# Altium schematic sheet DDR4_SODIMM1_Arria10.SchDoc: DDR4 SODIMM Arria10
size B; DocumentNumber: 21; SheetNumber: 21; SheetTotal: 46
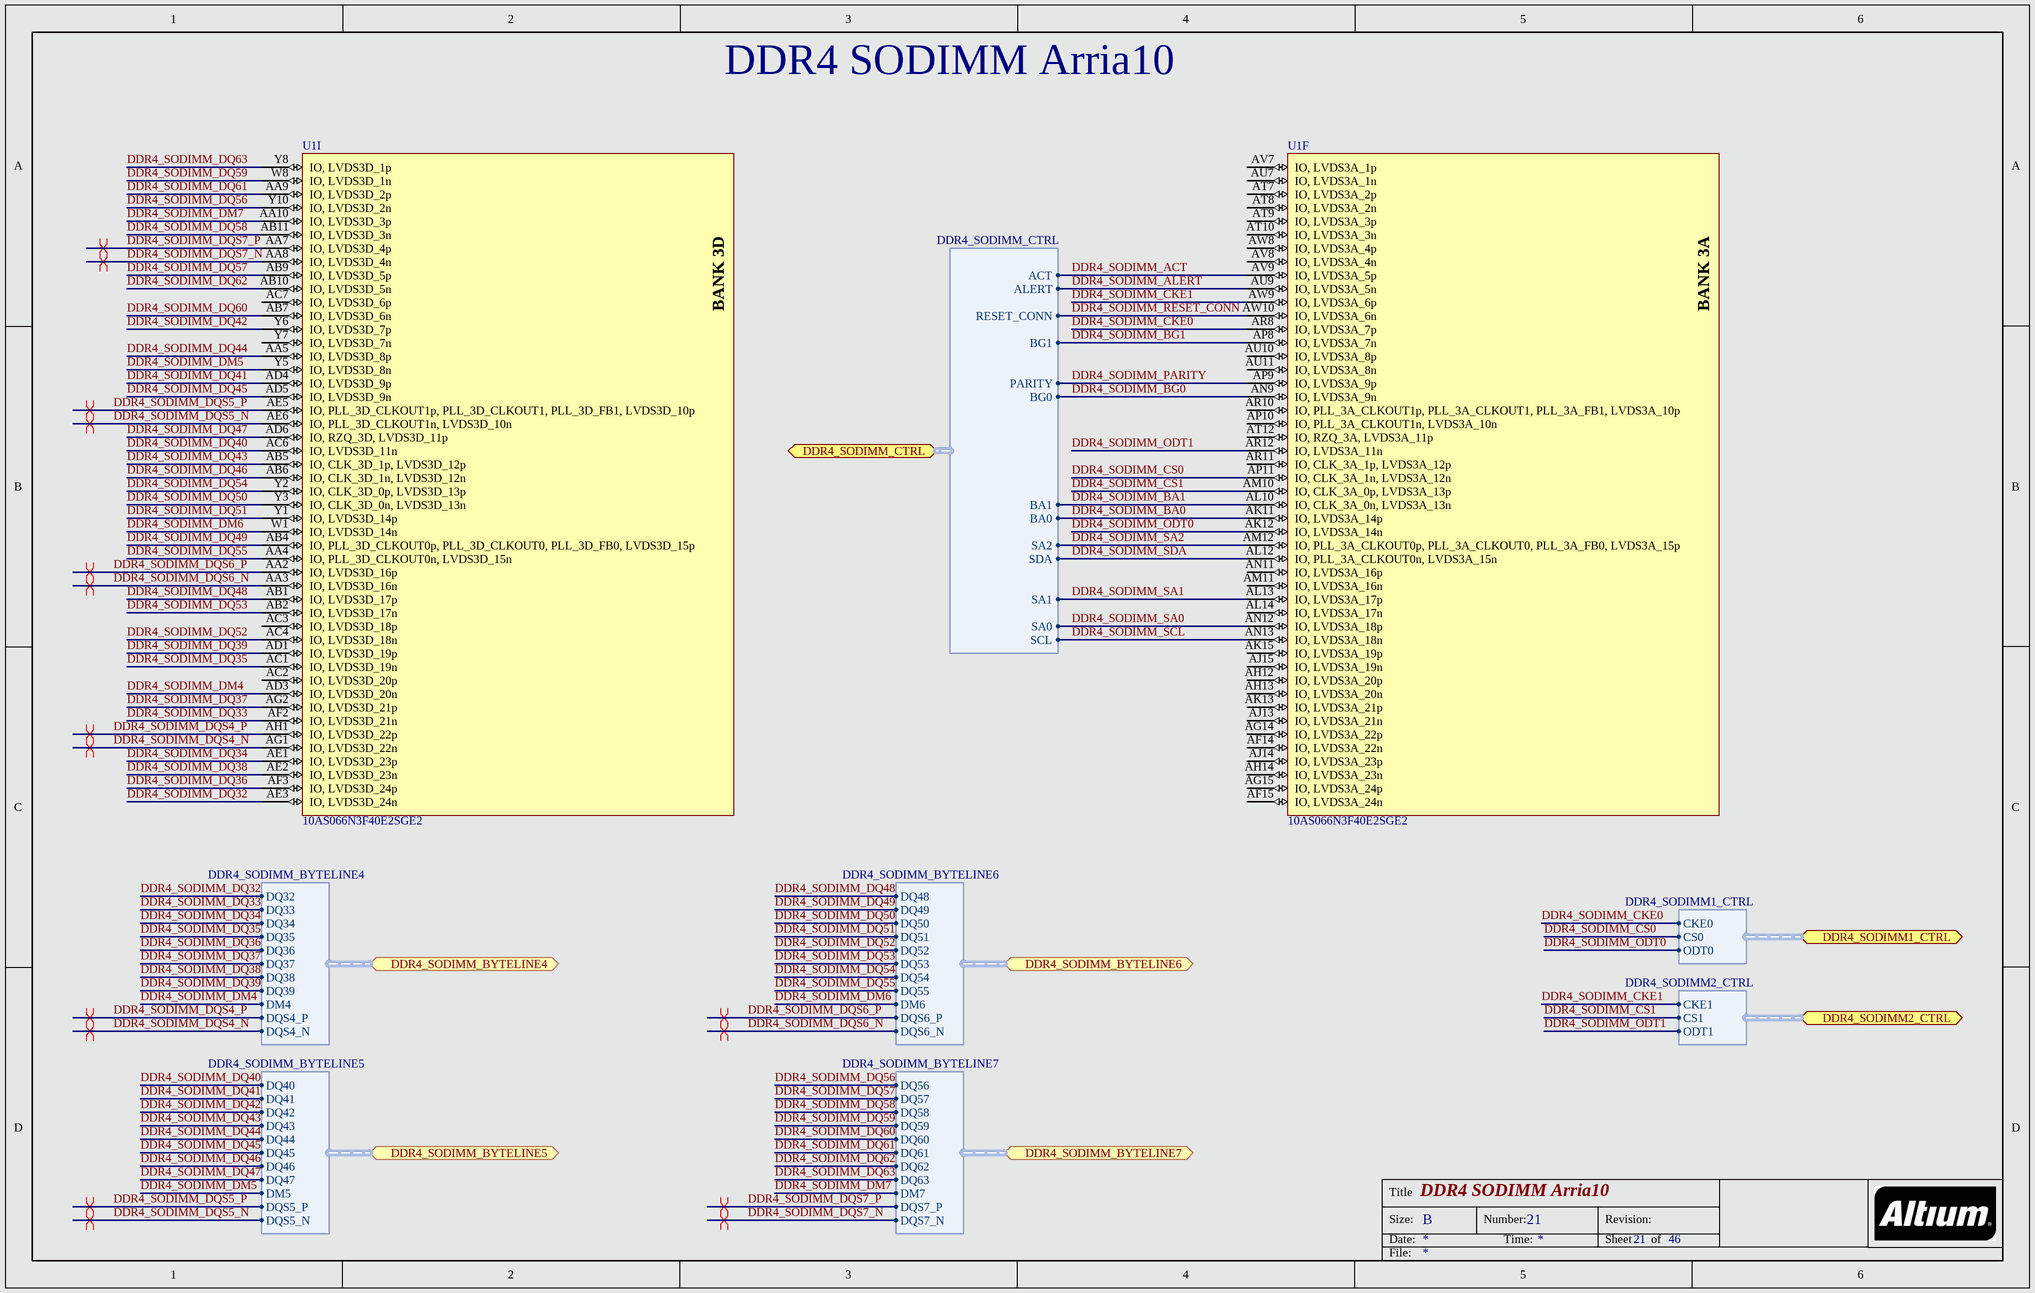
[diagram p0: DDR4_SODIMM1_Arria10.SchDoc]

## Parts
U1  10AS066N3F40E2SGE2  [ALTR-FBGA1517_A-350]  (parts F,I of 31)

## Ports
DDR4_SODIMM1_CTRL (harness DDR4_SODIMM1_CTRL), DDR4_SODIMM2_CTRL (harness DDR4_SODIMM2_CTRL), DDR4_SODIMM_BYTELINE4 (harness DDR4_SODIMM_BYTELINE4), DDR4_SODIMM_BYTELINE5 (harness DDR4_SODIMM_BYTELINE5), DDR4_SODIMM_BYTELINE6 (harness DDR4_SODIMM_BYTELINE6), DDR4_SODIMM_BYTELINE7 (harness DDR4_SODIMM_BYTELINE7), DDR4_SODIMM_CTRL (harness DDR4_SODIMM_CTRL)

## Harnesses
DDR4_SODIMM_BYTELINE4: DQ32, DQ33, DQ34, DQ35, DQ36, DQ37, DQ38, DQ39, DM4, DQS4_P, DQS4_N
DDR4_SODIMM_BYTELINE5: DQ40, DQ41, DQ42, DQ43, DQ44, DQ45, DQ46, DQ47, DM5, DQS5_P, DQS5_N
DDR4_SODIMM_BYTELINE6: DQ48, DQ49, DQ50, DQ51, DQ52, DQ53, DQ54, DQ55, DM6, DQS6_P, DQS6_N
DDR4_SODIMM_BYTELINE7: DQ56, DQ57, DQ58, DQ59, DQ60, DQ61, DQ62, DQ63, DM7, DQS7_P, DQS7_N
DDR4_SODIMM1_CTRL: CKE0, CS0, ODT0
DDR4_SODIMM2_CTRL: CKE1, CS1, ODT1
DDR4_SODIMM_CTRL: SA0, SA1, SA2, BA0, BA1, BG0, BG1, SCL, SDA, RESET_CONN, ACT, ALERT, PARITY

## Nets
DDR4_SODIMM_ACT: U1.AV9(IO,_LVDS3A_5p) ; port DDR4_SODIMM_CTRL.ACT
DDR4_SODIMM_ALERT: U1.AU9(IO,_LVDS3A_5n) ; port DDR4_SODIMM_CTRL.ALERT
DDR4_SODIMM_BA0: U1.AK11(IO,_LVDS3A_14p) ; port DDR4_SODIMM_CTRL.BA0
DDR4_SODIMM_BA1: U1.AL10(IO,_CLK_3A_0n,_LVDS3A_13n) ; port DDR4_SODIMM_CTRL.BA1
DDR4_SODIMM_BG0: U1.AN9(IO,_LVDS3A_9n) ; port DDR4_SODIMM_CTRL.BG0
DDR4_SODIMM_BG1: U1.AP8(IO,_LVDS3A_7n) ; port DDR4_SODIMM_CTRL.BG1
DDR4_SODIMM_CKE0: U1.AR8(IO,_LVDS3A_7p) ; port DDR4_SODIMM1_CTRL.CKE0
DDR4_SODIMM_CKE1: U1.AW9(IO,_LVDS3A_6p) ; port DDR4_SODIMM2_CTRL.CKE1
DDR4_SODIMM_CS0: U1.AP11(IO,_CLK_3A_1n,_LVDS3A_12n) ; port DDR4_SODIMM1_CTRL.CS0
DDR4_SODIMM_CS1: U1.AM10(IO,_CLK_3A_0p,_LVDS3A_13p) ; port DDR4_SODIMM2_CTRL.CS1
DDR4_SODIMM_DM4: U1.AD3(IO,_LVDS3D_20n) ; port DDR4_SODIMM_BYTELINE4.DM4
DDR4_SODIMM_DM5: U1.Y5(IO,_LVDS3D_8n) ; port DDR4_SODIMM_BYTELINE5.DM5
DDR4_SODIMM_DM6: U1.W1(IO,_LVDS3D_14n) ; port DDR4_SODIMM_BYTELINE6.DM6
DDR4_SODIMM_DM7: U1.AA10(IO,_LVDS3D_3p) ; port DDR4_SODIMM_BYTELINE7.DM7
DDR4_SODIMM_DQ32: U1.AE3(IO,_LVDS3D_24n) ; port DDR4_SODIMM_BYTELINE4.DQ32
DDR4_SODIMM_DQ33: U1.AF2(IO,_LVDS3D_21n) ; port DDR4_SODIMM_BYTELINE4.DQ33
DDR4_SODIMM_DQ34: U1.AE1(IO,_LVDS3D_23p) ; port DDR4_SODIMM_BYTELINE4.DQ34
DDR4_SODIMM_DQ35: U1.AC1(IO,_LVDS3D_19n) ; port DDR4_SODIMM_BYTELINE4.DQ35
DDR4_SODIMM_DQ36: U1.AF3(IO,_LVDS3D_24p) ; port DDR4_SODIMM_BYTELINE4.DQ36
DDR4_SODIMM_DQ37: U1.AG2(IO,_LVDS3D_21p) ; port DDR4_SODIMM_BYTELINE4.DQ37
DDR4_SODIMM_DQ38: U1.AE2(IO,_LVDS3D_23n) ; port DDR4_SODIMM_BYTELINE4.DQ38
DDR4_SODIMM_DQ39: U1.AD1(IO,_LVDS3D_19p) ; port DDR4_SODIMM_BYTELINE4.DQ39
DDR4_SODIMM_DQ40: U1.AC6(IO,_LVDS3D_11n) ; port DDR4_SODIMM_BYTELINE5.DQ40
DDR4_SODIMM_DQ41: U1.AD4(IO,_LVDS3D_9p) ; port DDR4_SODIMM_BYTELINE5.DQ41
DDR4_SODIMM_DQ42: U1.Y6(IO,_LVDS3D_7p) ; port DDR4_SODIMM_BYTELINE5.DQ42
DDR4_SODIMM_DQ43: U1.AB5(IO,_CLK_3D_1p,_LVDS3D_12p) ; port DDR4_SODIMM_BYTELINE5.DQ43
DDR4_SODIMM_DQ44: U1.AA5(IO,_LVDS3D_8p) ; port DDR4_SODIMM_BYTELINE5.DQ44
DDR4_SODIMM_DQ45: U1.AD5(IO,_LVDS3D_9n) ; port DDR4_SODIMM_BYTELINE5.DQ45
DDR4_SODIMM_DQ46: U1.AB6(IO,_CLK_3D_1n,_LVDS3D_12n) ; port DDR4_SODIMM_BYTELINE5.DQ46
DDR4_SODIMM_DQ47: U1.AD6(IO,_RZQ_3D,_LVDS3D_11p) ; port DDR4_SODIMM_BYTELINE5.DQ47
DDR4_SODIMM_DQ48: U1.AB1(IO,_LVDS3D_17p) ; port DDR4_SODIMM_BYTELINE6.DQ48
DDR4_SODIMM_DQ49: U1.AB4(IO,_PLL_3D_CLKOUT0p,_PLL_3D_CLKOUT0,_PLL_3D_FB0,_LVDS3D_15p) ; port DDR4_SODIMM_BYTELINE6.DQ49
DDR4_SODIMM_DQ50: U1.Y3(IO,_CLK_3D_0n,_LVDS3D_13n) ; port DDR4_SODIMM_BYTELINE6.DQ50
DDR4_SODIMM_DQ51: U1.Y1(IO,_LVDS3D_14p) ; port DDR4_SODIMM_BYTELINE6.DQ51
DDR4_SODIMM_DQ52: U1.AC4(IO,_LVDS3D_18n) ; port DDR4_SODIMM_BYTELINE6.DQ52
DDR4_SODIMM_DQ53: U1.AB2(IO,_LVDS3D_17n) ; port DDR4_SODIMM_BYTELINE6.DQ53
DDR4_SODIMM_DQ54: U1.Y2(IO,_CLK_3D_0p,_LVDS3D_13p) ; port DDR4_SODIMM_BYTELINE6.DQ54
DDR4_SODIMM_DQ55: U1.AA4(IO,_PLL_3D_CLKOUT0n,_LVDS3D_15n) ; port DDR4_SODIMM_BYTELINE6.DQ55
DDR4_SODIMM_DQ56: U1.Y10(IO,_LVDS3D_2n) ; port DDR4_SODIMM_BYTELINE7.DQ56
DDR4_SODIMM_DQ57: U1.AB9(IO,_LVDS3D_5p) ; port DDR4_SODIMM_BYTELINE7.DQ57
DDR4_SODIMM_DQ58: U1.AB11(IO,_LVDS3D_3n) ; port DDR4_SODIMM_BYTELINE7.DQ58
DDR4_SODIMM_DQ59: U1.W8(IO,_LVDS3D_1n) ; port DDR4_SODIMM_BYTELINE7.DQ59
DDR4_SODIMM_DQ60: U1.AB7(IO,_LVDS3D_6n) ; port DDR4_SODIMM_BYTELINE7.DQ60
DDR4_SODIMM_DQ61: U1.AA9(IO,_LVDS3D_2p) ; port DDR4_SODIMM_BYTELINE7.DQ61
DDR4_SODIMM_DQ62: U1.AB10(IO,_LVDS3D_5n) ; port DDR4_SODIMM_BYTELINE7.DQ62
DDR4_SODIMM_DQ63: U1.Y8(IO,_LVDS3D_1p) ; port DDR4_SODIMM_BYTELINE7.DQ63
DDR4_SODIMM_DQS4_N: U1.AG1(IO,_LVDS3D_22n) ; port DDR4_SODIMM_BYTELINE4.DQS4_N
DDR4_SODIMM_DQS4_P: U1.AH1(IO,_LVDS3D_22p) ; port DDR4_SODIMM_BYTELINE4.DQS4_P
DDR4_SODIMM_DQS5_N: U1.AE6(IO,_PLL_3D_CLKOUT1n,_LVDS3D_10n) ; port DDR4_SODIMM_BYTELINE5.DQS5_N
DDR4_SODIMM_DQS5_P: U1.AE5(IO,_PLL_3D_CLKOUT1p,_PLL_3D_CLKOUT1,_PLL_3D_FB1,_LVDS3D_10p) ; port DDR4_SODIMM_BYTELINE5.DQS5_P
DDR4_SODIMM_DQS6_N: U1.AA3(IO,_LVDS3D_16n) ; port DDR4_SODIMM_BYTELINE6.DQS6_N
DDR4_SODIMM_DQS6_P: U1.AA2(IO,_LVDS3D_16p) ; port DDR4_SODIMM_BYTELINE6.DQS6_P
DDR4_SODIMM_DQS7_N: U1.AA8(IO,_LVDS3D_4n) ; port DDR4_SODIMM_BYTELINE7.DQS7_N
DDR4_SODIMM_DQS7_P: U1.AA7(IO,_LVDS3D_4p) ; port DDR4_SODIMM_BYTELINE7.DQS7_P
DDR4_SODIMM_ODT0: U1.AK12(IO,_LVDS3A_14n) ; port DDR4_SODIMM1_CTRL.ODT0
DDR4_SODIMM_ODT1: U1.AR12(IO,_LVDS3A_11n) ; port DDR4_SODIMM2_CTRL.ODT1
DDR4_SODIMM_PARITY: U1.AP9(IO,_LVDS3A_9p) ; port DDR4_SODIMM_CTRL.PARITY
DDR4_SODIMM_RESET_CONN: U1.AW10(IO,_LVDS3A_6n) ; port DDR4_SODIMM_CTRL.RESET_CONN
DDR4_SODIMM_SA0: U1.AN12(IO,_LVDS3A_18p) ; port DDR4_SODIMM_CTRL.SA0
DDR4_SODIMM_SA1: U1.AL13(IO,_LVDS3A_17p) ; port DDR4_SODIMM_CTRL.SA1
DDR4_SODIMM_SA2: U1.AM12(IO,_PLL_3A_CLKOUT0p,_PLL_3A_CLKOUT0,_PLL_3A_FB0,_LVDS3A_15p) ; port DDR4_SODIMM_CTRL.SA2
DDR4_SODIMM_SCL: U1.AN13(IO,_LVDS3A_18n) ; port DDR4_SODIMM_CTRL.SCL
DDR4_SODIMM_SDA: U1.AL12(IO,_PLL_3A_CLKOUT0n,_LVDS3A_15n) ; port DDR4_SODIMM_CTRL.SDA

Not connected (* = marked no-connect by the designer): U1 AC2(IO,_LVDS3D_20p) AC3(IO,_LVDS3D_18p) AC7(IO,_LVDS3D_6p) AF14(IO,_LVDS3A_22n) AF15(IO,_LVDS3A_24n) AG14(IO,_LVDS3A_22p) AG15(IO,_LVDS3A_24p) AH12(IO,_LVDS3A_20p) AH13(IO,_LVDS3A_20n) AH14(IO,_LVDS3A_23n) AJ13(IO,_LVDS3A_21n) AJ14(IO,_LVDS3A_23p) AJ15(IO,_LVDS3A_19n) AK13(IO,_LVDS3A_21p) AK15(IO,_LVDS3A_19p) AL14(IO,_LVDS3A_17n) AM11(IO,_LVDS3A_16n) AN11(IO,_LVDS3A_16p) AP10(IO,_PLL_3A_CLKOUT1n,_LVDS3A_10n) AR10(IO,_PLL_3A_CLKOUT1p,_PLL_3A_CLKOUT1,_PLL_3A_FB1,_LVDS3A_10p) AR11(IO,_CLK_3A_1p,_LVDS3A_12p) AT7(IO,_LVDS3A_2p) AT8(IO,_LVDS3A_2n) AT9(IO,_LVDS3A_3p) AT10(IO,_LVDS3A_3n) AT12(IO,_RZQ_3A,_LVDS3A_11p) AU7(IO,_LVDS3A_1n) AU10(IO,_LVDS3A_8p) AU11(IO,_LVDS3A_8n) AV7(IO,_LVDS3A_1p) AV8(IO,_LVDS3A_4n) AW8(IO,_LVDS3A_4p) Y7(IO,_LVDS3D_7n)

## Layout directives
differential pair: DDR4_SODIMM_DQS4_N, DDR4_SODIMM_DQS4_P, DDR4_SODIMM_DQS5_N, DDR4_SODIMM_DQS5_P, DDR4_SODIMM_DQS6_N, DDR4_SODIMM_DQS6_P, DDR4_SODIMM_DQS7_N, DDR4_SODIMM_DQS7_P

## Notes on the sheet
- Title
- Size:
- Date:
- B
- Number:
- Time:
- Revision:
- Sheet
- of
- File:
- (in symbol CMP-1689-00006-3, part F) BANK 3A
- (in symbol CMP-1689-00006-3, part I) BANK 3D

## Library data of the parts
U1 = CMP-1689-00006-3: Arria 10 SX Family, 588 I/O Pins, 16 Fractional PLLs, 1517-Pin FBGA, Speed Grade 2, Extended Grade, RoHS; ComponentLink3Description: Package Specification; PackageVersion: Rev. 5.0, 01/2016; ComponentLink3URL: https://www.altera.com/content/dam/altera-www/global/en_US/pdfs/literature/packaging/04r00461-04.pdf; ComponentLink2Description: Datasheet; Code_JEDEC: MS-034; Mounting Technology: Surface Mount; PartNumber: 10AS066N3F40E2SGE2; PackageDescription: 1517-Pin FineLine Ball-Grid Array (FBGA), Body 40 x 40 mm, Pitch 1 mm; ComponentLink2URL: https://www.altera.com/content/dam/altera-www/global/en_US/pdfs/literature/hb/arria-10/a10_datasheet.pdf; ComponentLink1URL: https://www.altera.com/; DatasheetVersion: Rev. 2016-06-24, 06/2016; ComponentLink1Description: Manufacturer URL